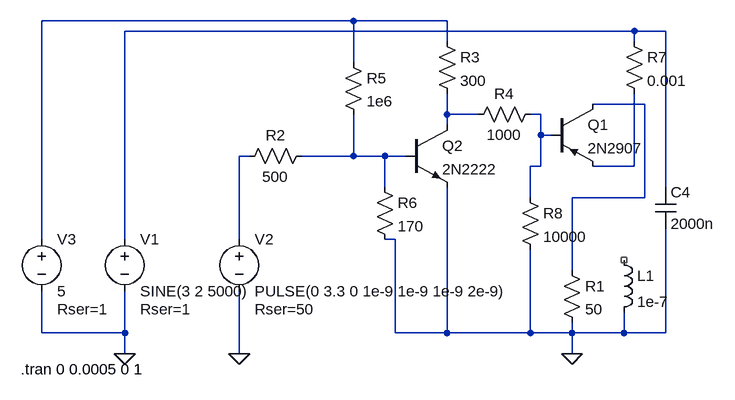
[diagram p0: schematic NPN.asc]
NPN.asc, the LTspice schematic file:
Version 4
SHEET 1 880 680
WIRE 16 -192 -464 -192
WIRE 160 -192 16 -192
WIRE 448 -176 -336 -176
WIRE 496 -176 448 -176
WIRE 160 -160 160 -192
WIRE 448 -160 448 -176
WIRE 16 -128 16 -192
WIRE 464 -64 384 -64
WIRE 160 -48 160 -80
WIRE 208 -48 160 -48
WIRE 304 -48 288 -48
WIRE 160 -32 160 -48
WIRE 304 -16 304 -48
WIRE 320 -16 304 -16
WIRE -144 16 -160 16
WIRE 16 16 16 -48
WIRE 16 16 -64 16
WIRE 64 16 16 16
WIRE 96 16 64 16
WIRE 304 32 304 -16
WIRE 304 32 288 32
WIRE 448 32 448 -80
WIRE 448 32 384 32
WIRE 64 64 64 16
WIRE 496 64 496 -176
WIRE 288 80 288 32
WIRE 464 80 464 -64
WIRE 464 80 352 80
WIRE -464 144 -464 -192
WIRE -336 144 -336 -176
WIRE -160 144 -160 16
WIRE 80 144 64 144
WIRE 352 192 352 80
WIRE -464 288 -464 224
WIRE -336 288 -336 224
WIRE -336 288 -464 288
WIRE 80 288 80 144
WIRE 160 288 160 64
WIRE 160 288 80 288
WIRE 288 288 288 160
WIRE 288 288 160 288
WIRE 352 288 352 272
WIRE 352 288 288 288
WIRE 432 288 432 256
WIRE 432 288 352 288
WIRE 496 288 496 128
WIRE 496 288 432 288
WIRE -336 320 -336 288
WIRE -160 320 -160 224
WIRE 352 320 352 288
FLAG -336 320 0
FLAG -160 320 0
FLAG 352 320 0
SYMBOL voltage -336 128 R0
WINDOW 123 0 0 Left 0
WINDOW 39 24 124 Left 2
SYMATTR SpiceLine Rser=1
SYMATTR InstName V1
SYMATTR Value SINE(3 2 5000)
SYMBOL voltage -160 128 R0
WINDOW 123 0 0 Left 0
WINDOW 39 24 124 Left 2
SYMATTR SpiceLine Rser=50
SYMATTR InstName V2
SYMATTR Value PULSE(0 3.3 0 1e-9 1e-9 1e-9 2e-9)
SYMBOL res 336 176 R0
SYMATTR InstName R1
SYMATTR Value 50
SYMBOL cap 480 64 R0
SYMATTR InstName C4
SYMATTR Value 2000n
SYMBOL voltage -464 128 R0
WINDOW 123 0 0 Left 0
WINDOW 39 24 124 Left 2
SYMATTR SpiceLine Rser=1
SYMATTR InstName V3
SYMATTR Value 5
SYMBOL pnp 320 -64 R0
SYMATTR InstName Q1
SYMATTR Value 2N2907
SYMBOL res -48 0 R90
WINDOW 0 0 56 VBottom 2
WINDOW 3 32 56 VTop 2
SYMATTR InstName R2
SYMATTR Value 500
SYMBOL npn 96 -32 R0
SYMATTR InstName Q2
SYMATTR Value 2N2222
SYMBOL res 144 -176 R0
SYMATTR InstName R3
SYMATTR Value 300
SYMBOL res 304 -64 R90
WINDOW 0 0 56 VBottom 2
WINDOW 3 32 56 VTop 2
SYMATTR InstName R4
SYMATTR Value 1000
SYMBOL res 0 -144 R0
SYMATTR InstName R5
SYMATTR Value 1e6
SYMBOL res 48 48 R0
SYMATTR InstName R6
SYMATTR Value 170
SYMBOL res 432 -176 R0
SYMATTR InstName R7
SYMATTR Value 0.001
SYMBOL ind 416 160 R0
SYMATTR InstName L1
SYMATTR Value 1e-7
SYMATTR SpiceLine Ipk=0.2 Rser=100
SYMBOL res 272 64 R0
SYMATTR InstName R8
SYMATTR Value 10000
TEXT -496 344 Left 2 !.tran 0 0.0005 0 1

The netlist it stands for:
* NPN.asc
V1 N002 0 SINE(3 2 5000) Rser=1
V2 N006 0 PULSE(0 3.3 0 1e-9 1e-9 1e-9 2e-9) Rser=50
R1 N003 0 50
C4 N002 0 2000n
V3 N001 0 5 Rser=1
Q1 N003 N005 N008 0 2N2907
R2 N007 N006 500
Q2 N004 N007 0 0 2N2222
R3 N001 N004 300
R4 N005 N004 1000
R5 N001 N007 1e6
R6 N007 0 170
R7 N002 N008 0.001
L1 NC_01 0 1e-7 Ipk=0.2 Rser=100
R8 N005 0 10000
.model NPN NPN
.model PNP PNP
.lib standard.bjt
.tran 0 0.0005 0 1
.backanno
.end